# Altium project FET_Driver.PrjPcb (part 2 of 3)

## Sheet analog_converter.SchDoc
size B; Address1: MILWAUKEE TOOL; Address2: 13135 W. Lisbon Rd.; Address3: Brookfield, WI 53005; SheetNumber: 1; SheetTotal: 1
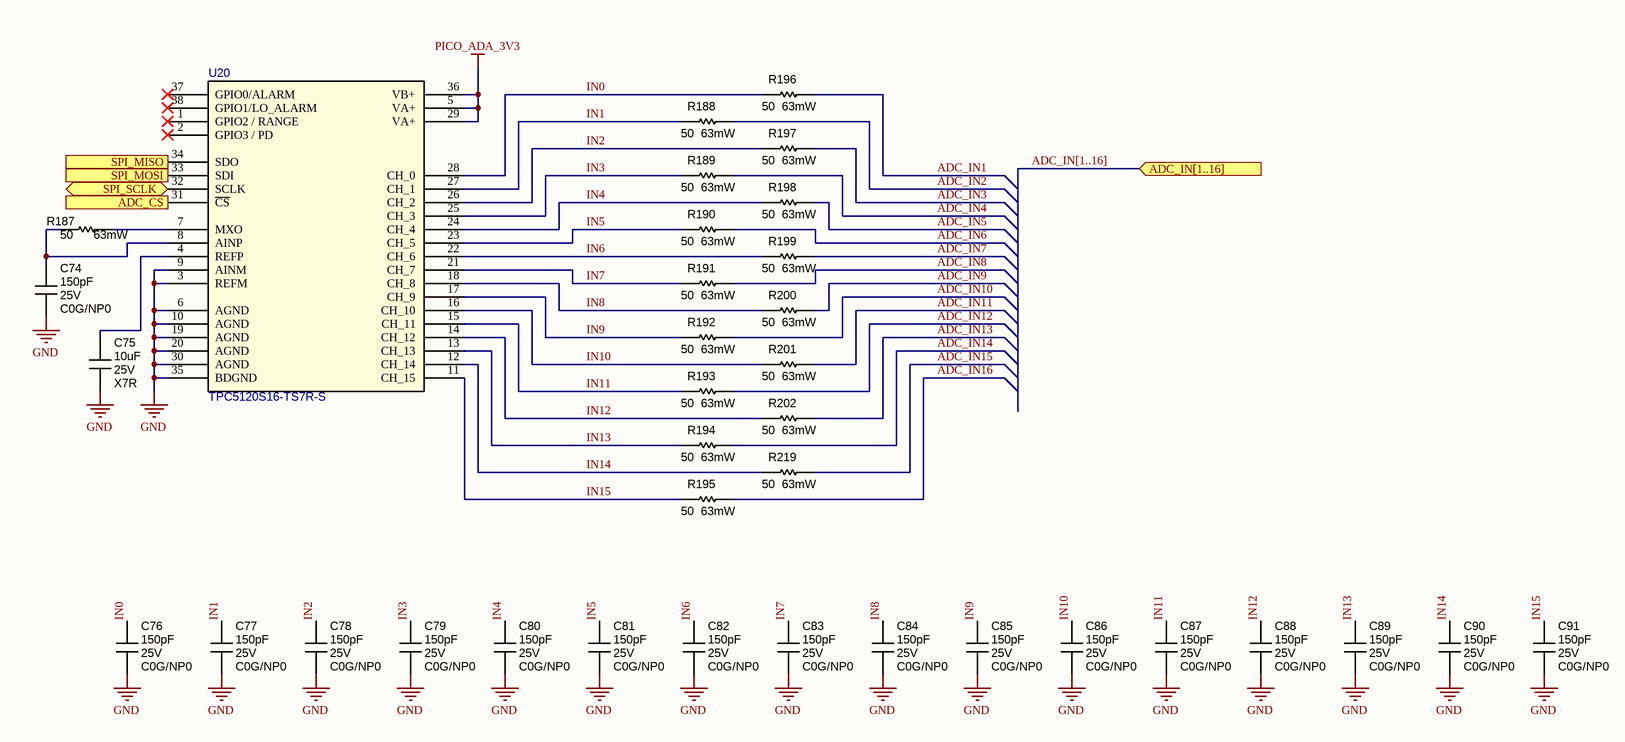
[diagram p5: analog_converter.SchDoc]

### Parts
C74  150pF  Voltage Rating: 25V  Temp Coeff: C0G/NP0  [CAPC1005X06N]
C75  10uF  Voltage Rating: 25V  Temp Coeff: X7R  [CAPC3225X28N]
C76  150pF  Voltage Rating: 25V  Temp Coeff: C0G/NP0  [CAPC1005X06N]
C77  150pF  Voltage Rating: 25V  Temp Coeff: C0G/NP0  [CAPC1005X06N]
C78  150pF  Voltage Rating: 25V  Temp Coeff: C0G/NP0  [CAPC1005X06N]
C79  150pF  Voltage Rating: 25V  Temp Coeff: C0G/NP0  [CAPC1005X06N]
C80  150pF  Voltage Rating: 25V  Temp Coeff: C0G/NP0  [CAPC1005X06N]
C81  150pF  Voltage Rating: 25V  Temp Coeff: C0G/NP0  [CAPC1005X06N]
C82  150pF  Voltage Rating: 25V  Temp Coeff: C0G/NP0  [CAPC1005X06N]
C83  150pF  Voltage Rating: 25V  Temp Coeff: C0G/NP0  [CAPC1005X06N]
C84  150pF  Voltage Rating: 25V  Temp Coeff: C0G/NP0  [CAPC1005X06N]
C85  150pF  Voltage Rating: 25V  Temp Coeff: C0G/NP0  [CAPC1005X06N]
C86  150pF  Voltage Rating: 25V  Temp Coeff: C0G/NP0  [CAPC1005X06N]
C87  150pF  Voltage Rating: 25V  Temp Coeff: C0G/NP0  [CAPC1005X06N]
C88  150pF  Voltage Rating: 25V  Temp Coeff: C0G/NP0  [CAPC1005X06N]
C89  150pF  Voltage Rating: 25V  Temp Coeff: C0G/NP0  [CAPC1005X06N]
C90  150pF  Voltage Rating: 25V  Temp Coeff: C0G/NP0  [CAPC1005X06N]
C91  150pF  Voltage Rating: 25V  Temp Coeff: C0G/NP0  [CAPC1005X06N]
R187  50  Wattage: 63mW  [RESC1005X04N]
R188  50  Wattage: 63mW  [RESC1005X04N]
R189  50  Wattage: 63mW  [RESC1005X04N]
R190  50  Wattage: 63mW  [RESC1005X04N]
R191  50  Wattage: 63mW  [RESC1005X04N]
R192  50  Wattage: 63mW  [RESC1005X04N]
R193  50  Wattage: 63mW  [RESC1005X04N]
R194  50  Wattage: 63mW  [RESC1005X04N]
R195  50  Wattage: 63mW  [RESC1005X04N]
R196  50  Wattage: 63mW  [RESC1005X04N]
R197  50  Wattage: 63mW  [RESC1005X04N]
R198  50  Wattage: 63mW  [RESC1005X04N]
R199  50  Wattage: 63mW  [RESC1005X04N]
R200  50  Wattage: 63mW  [RESC1005X04N]
R201  50  Wattage: 63mW  [RESC1005X04N]
R202  50  Wattage: 63mW  [RESC1005X04N]
R219  50  Wattage: 63mW  [RESC1005X04N]
U20  TPC5120S16-TS7R-S  [TSSOP50P640X120-38N]

### Ports
ADC_CS (in), ADC_IN[1..16] (in), SPI_MISO (out), SPI_MOSI (in), SPI_SCLK (bidir)

### Nets
GND: C74.2 C75.2 C76.2 C77.2 C78.2 C79.2 C80.2 C81.2 C82.2 C83.2 C84.2 C85.2 C86.2 C87.2 C88.2 C89.2 C90.2 C91.2 U20.3(REFM) U20.6(AGND) U20.9(AINM) U20.10(AGND) U20.19(AGND) U20.20(AGND) U20.30(AGND) U20.35(BDGND)
PICO_ADA_3V3: U20.5(VA+) U20.29(VA+) U20.36(VB+)
ADC_CHIP_SEL: U20.31(~{CS}) ; port ADC_CS
ADC_IN1: R196.2
ADC_IN2: R188.2
ADC_IN3: R197.2
ADC_IN4: R189.2
ADC_IN5: R198.2
ADC_IN6: R190.2
ADC_IN7: R199.2
ADC_IN8: R191.2
ADC_IN9: R200.2
ADC_IN10: R192.2
ADC_IN11: R201.2
ADC_IN12: R193.2
ADC_IN13: R202.2
ADC_IN14: R194.2
ADC_IN15: R219.2
ADC_IN16: R195.2
IN0: C76.1 R196.1 U20.28(CH_0)
IN1: C77.1 R188.1 U20.27(CH_1)
IN2: C78.1 R197.1 U20.26(CH_2)
IN3: C79.1 R189.1 U20.25(CH_3)
IN4: C80.1 R198.1 U20.24(CH_4)
IN5: C81.1 R190.1 U20.23(CH_5)
IN6: C82.1 R199.1 U20.22(CH_6)
IN7: C83.1 R191.1 U20.21(CH_7)
IN8: C84.1 R200.1 U20.18(CH_8)
IN9: C85.1 R192.1 U20.17(CH_9)
IN10: C86.1 R201.1 U20.16(CH_10)
IN11: C87.1 R193.1 U20.15(CH_11)
IN12: C88.1 R202.1 U20.14(CH_12)
IN13: C89.1 R194.1 U20.13(CH_13)
IN14: C90.1 R219.1 U20.12(CH_14)
IN15: C91.1 R195.1 U20.11(CH_15)
SPI0_CLK: U20.32(SCLK) ; port SPI_SCLK
SPI0_MISO: U20.34(SDO) ; port SPI_MISO
SPI0_MOSI: U20.33(SDI) ; port SPI_MOSI
NetC74_1: C74.1 R187.1 U20.8(AINP)
NetC75_1: C75.1 U20.4(REFP)
NetR187_2: R187.2 U20.7(MXO)

Not connected (* = marked no-connect by the designer): U20 1(GPIO2_/_RANGE)* 2(GPIO3_/_PD)* 37(GPIO0/ALARM)* 38(GPIO1/LO_ALARM)*

### Buses and harness runs
bus ADC_IN[1..16] = port ADC_IN[1..16]

### Notes on the sheet
- Schematic Notes
- Schematic Revision History
- Title
- ALL CAPACITORS ARE CERAMIC, 0603, 50V, 10%, X7R UNLESS OTHERWISE STATED
- ALL RESISTORS ARE FILM, 0603, 1/10W, 5%, 200ppm/°C UNLESS OTHERWISE STATED
- Size:
- Date:
- B
- Number:
- Sheet
- Revision:
- of
- Drawn By:
- Brookfield, WI 53005
- File:
- Platform Base:
- Engineer:
- This Document is the property of MILWAUKEE TOOL and may not be reproduced, in any form, without the written premission of MILWAUKEE TOOL.

### Library data of the parts
C74 C76-C91 = CMP-004-0079: CAP CER 150PF 25V C0G/NP0 0402; MFR#: C0402C151J3GACTU; MFR: KEMET; MFR2#: CC0402JRNPO8BN151; Tolerance: 5%; Populate: Yes; Temp Range: -55 / +125 C; Capacitor Type: Ceramic; Case Code (Imperial): 0402; Value: 150pF; Design Item ID: CN/150PF/25V/C0G,NP0/5%/0402; Case Code (Metric): 1005; ComponentLink1URL: https://search.murata.co.jp/Ceramy/image/img/A01X/G101/ENG/GCM155R71H103KA55-01.pdf; MFR2: Yageo; ComponentLink1Description: Datasheet; RoHS Compliant: Yes; Part Status: Production
C75 = CMP-004-0004: CAP CER 10UF 25V X7R 1206; MFR#: GRM31CR71E106KA12L; MFR2#: C3216X7R1E106K160AB; MFR: Murata Electronics; Capacitor Type: Ceramic; Tolerance: 10%; Temp Range: -55 / +125 C; REACH SVHC: Yes; Value: 10uF; Height: 1.6mm; ComponentLink1Description: Datasheet; MFR2: TDK Corporation; Case Code (Metric): 3216; ComponentLink1URL: https://www.murata.com/-/media/webrenewal/support/library/catalog/products/capacitor/ceramiccapacitor/c02e.ashx?la=en-us&cvid=20210120024548000000; RoHS Compliant: Yes; Case Code (Imperial): 1206; Design Item ID: CN/10uF/25V/X7R/10%/1206
R187-R202 R219 = CMP-025-0174: RES SMD 50R OHM 1% 1/16W 0402; MFR#: RN73R1ETTP50R0F50; MFR: KOA Speer Electronics; Value: 50 Ohm; Temp Range: -55 / +155 C; Temperature Coefficient: 50 ppm/°C; Populate: Yes; Tolerance: 1%; ComponentLink1Description: Datasheet; ComponentLink1URL: https://www.koaspeer.com/pdfs/RN73R.pdf; Resistor Type: Thick Film; Case Code (Imperial): 0402; Case Code (Metric): 1005; Design Item ID: R/50.0/0.063W/1%/0402; RoHS Compliant: Yes; Part Status: Production
U20 = CMP-017-0116: IC 12 BIT ANALOG TO DIGITAL CONVERT SPI; MFR: 3PEAK; Populate: Yes; REACFH SVCH: Unaffected; Temp Range, Ambient: -40 / +125 C; Voltage Range: 2.7V - 5.25V DC; Temp Range, Junction: -40 / +150C; Value: TPC5120S16-TS7R-S; MFR#: TPC5120S16-TS7R-S; Case Package: TSSOP38; Design Item ID: IC/ADC/12BIT/TPC5120S16-TS7R-S/3PEAK; Part Status: Production; RoHS Comliant: Yes; Type: THERMOCOUPLE; ComponentLink1Description: Datasheet; ComponentLink1URL: https://static.3peak.com/res/doc/ds/Datasheet_TPC5120-TPC5121.pdf

## Sheet display.SchDoc
size B; Address1: MILWAUKEE TOOL; Address2: 13135 W. Lisbon Rd.; Address3: Brookfield, WI 53005; SheetNumber: 1; SheetTotal: 1
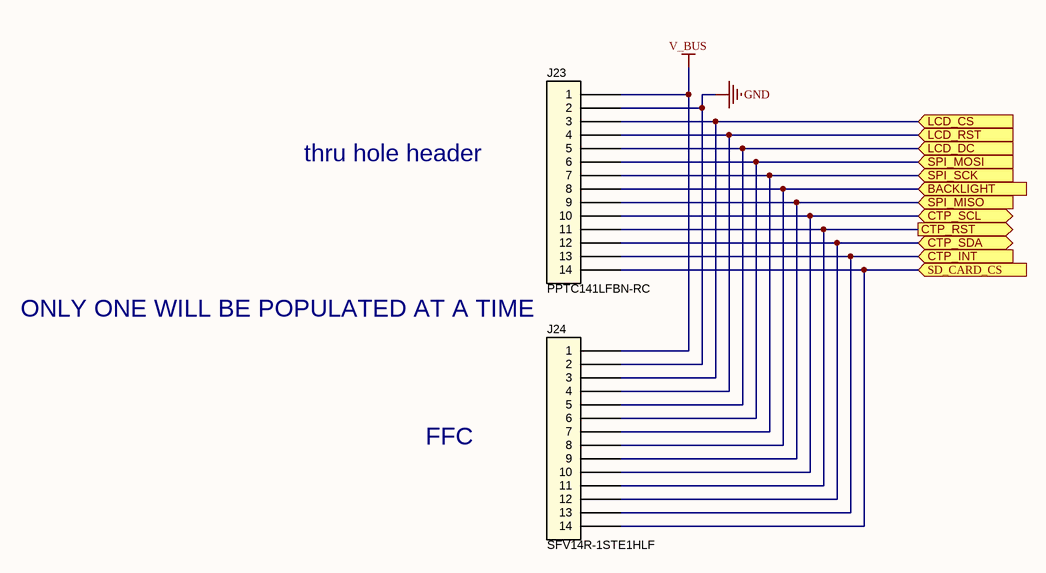
[diagram p6: display.SchDoc]

### Parts
J23  PPTC141LFBN-RC  [CONN_SULLINS_PPTC141LFBN-RC]
J24  SFV14R-1STE1HLF  [CONN_AMPHENOL_SFV14R-1STE1HLF]

### Ports
BACKLIGHT (in), CTP_INT (in), CTP_RST (out), CTP_SCL (bidir), CTP_SDA (bidir), LCD_CS (in), LCD_DC (in), LCD_RST (in), SD_CARD_CS (in), SPI_MISO (in), SPI_MOSI (in), SPI_SCK (in)

### Nets
GND: J23.2 J24.2
V_BUS: J23.1 J24.1
CAP_TOUCH_INT: J23.13 J24.13 ; port CTP_INT
CAP_TOUCH_RST: J23.11 J24.11 ; port CTP_RST
DISP_BACKLIGHT: J23.8 J24.8 ; port BACKLIGHT
DISP_CS: J23.3 J24.3 ; port LCD_CS
DISP_DC: J23.5 J24.5 ; port LCD_DC
DISP_RST: J23.4 J24.4 ; port LCD_RST
DISP_SD_CARD_CS: J23.14 J24.14 ; port SD_CARD_CS
I2C0_SCL: J23.10 J24.10 ; port CTP_SCL
I2C0_SDA: J23.12 J24.12 ; port CTP_SDA
SPI0_CLK: J23.7 J24.7 ; port SPI_SCK
SPI0_MISO: J23.9 J24.9 ; port SPI_MISO
SPI0_MOSI: J23.6 J24.6 ; port SPI_MOSI

### Notes on the sheet
- thru hole header
- ONLY ONE WILL BE POPULATED AT A TIME
- FFC
- Schematic Notes
- Schematic Revision History
- Title
- ALL CAPACITORS ARE CERAMIC, 0603, 50V, 10%, X7R UNLESS OTHERWISE STATED
- ALL RESISTORS ARE FILM, 0603, 1/10W, 5%, 200ppm/°C UNLESS OTHERWISE STATED
- Size:
- Date:
- B
- Number:
- Sheet
- Revision:
- of
- Drawn By:
- Brookfield, WI 53005
- File:
- Platform Base:
- Engineer:
- This Document is the property of MILWAUKEE TOOL and may not be reproduced, in any form, without the written premission of MILWAUKEE TOOL.

### Library data of the parts
J23 = CMP-007-0083: CONN HEADER RECEPTACLE VERT 14POS 2.54MM GOLD; MFR: Sullins Connector Solutions; Voltage Rating: 250V AC(RMS)/DC; Durability: 50 mating cycles; Current Rating: 1A; System: Connector; Temp Range: -40 / +105 C; Gender: Male; Value: PPTC141LFBN-RC; Orientation: Verticle; Terminal Pitch: 2.54mm; RoHS Compliant: Yes; Design Item ID: CON/14P/2.54mm/1A/PPTC141LFBN-RC/SULLINS; MFR#: PPTC141LFBN-RC; Contact Finish: Tin; ComponentLink1Description: Drawing; ComponentLink1URL: https://mm.digikey.com/Volume0/opasdata/d220001/medias/docus/937/Female_Headers.100_DS.pdf
J24 = CMP-007-0082: CONN FFC BOTTOM 14POS 0.5MM R/A; MFR: Amphenol ICC (FCI); Voltage Rating: 250V AC(RMS)/DC; Durability: 50 mating cycles; Current Rating: 0.5A; System: Connector; Temp Range: -55 / +105 C; Gender: Male; Value: SFV14R-1STE1HLF; Orientation: Right Angle; Terminal Pitch: 0.5mm; RoHS Compliant: Yes; Design Item ID: CON/14P/0.5mm/0.5A/SFV14R-1STBE1HLF/Amphenol; MFR#: SFV14R-1STE1HLF; Contact Finish: Gold; ComponentLink1Description: Drawing; ComponentLink1URL: https://cdn.amphenol-cs.com/media/wysiwyg/files/documentation/datasheet/flex/flexconnectors_050mm_sfvr.pdf

## Sheet thermocouple_1.SchDoc
size B; Address1: MILWAUKEE TOOL; Address2: 13135 W. Lisbon Rd.; Address3: Brookfield, WI 53005; SheetNumber: 1; SheetTotal: 1
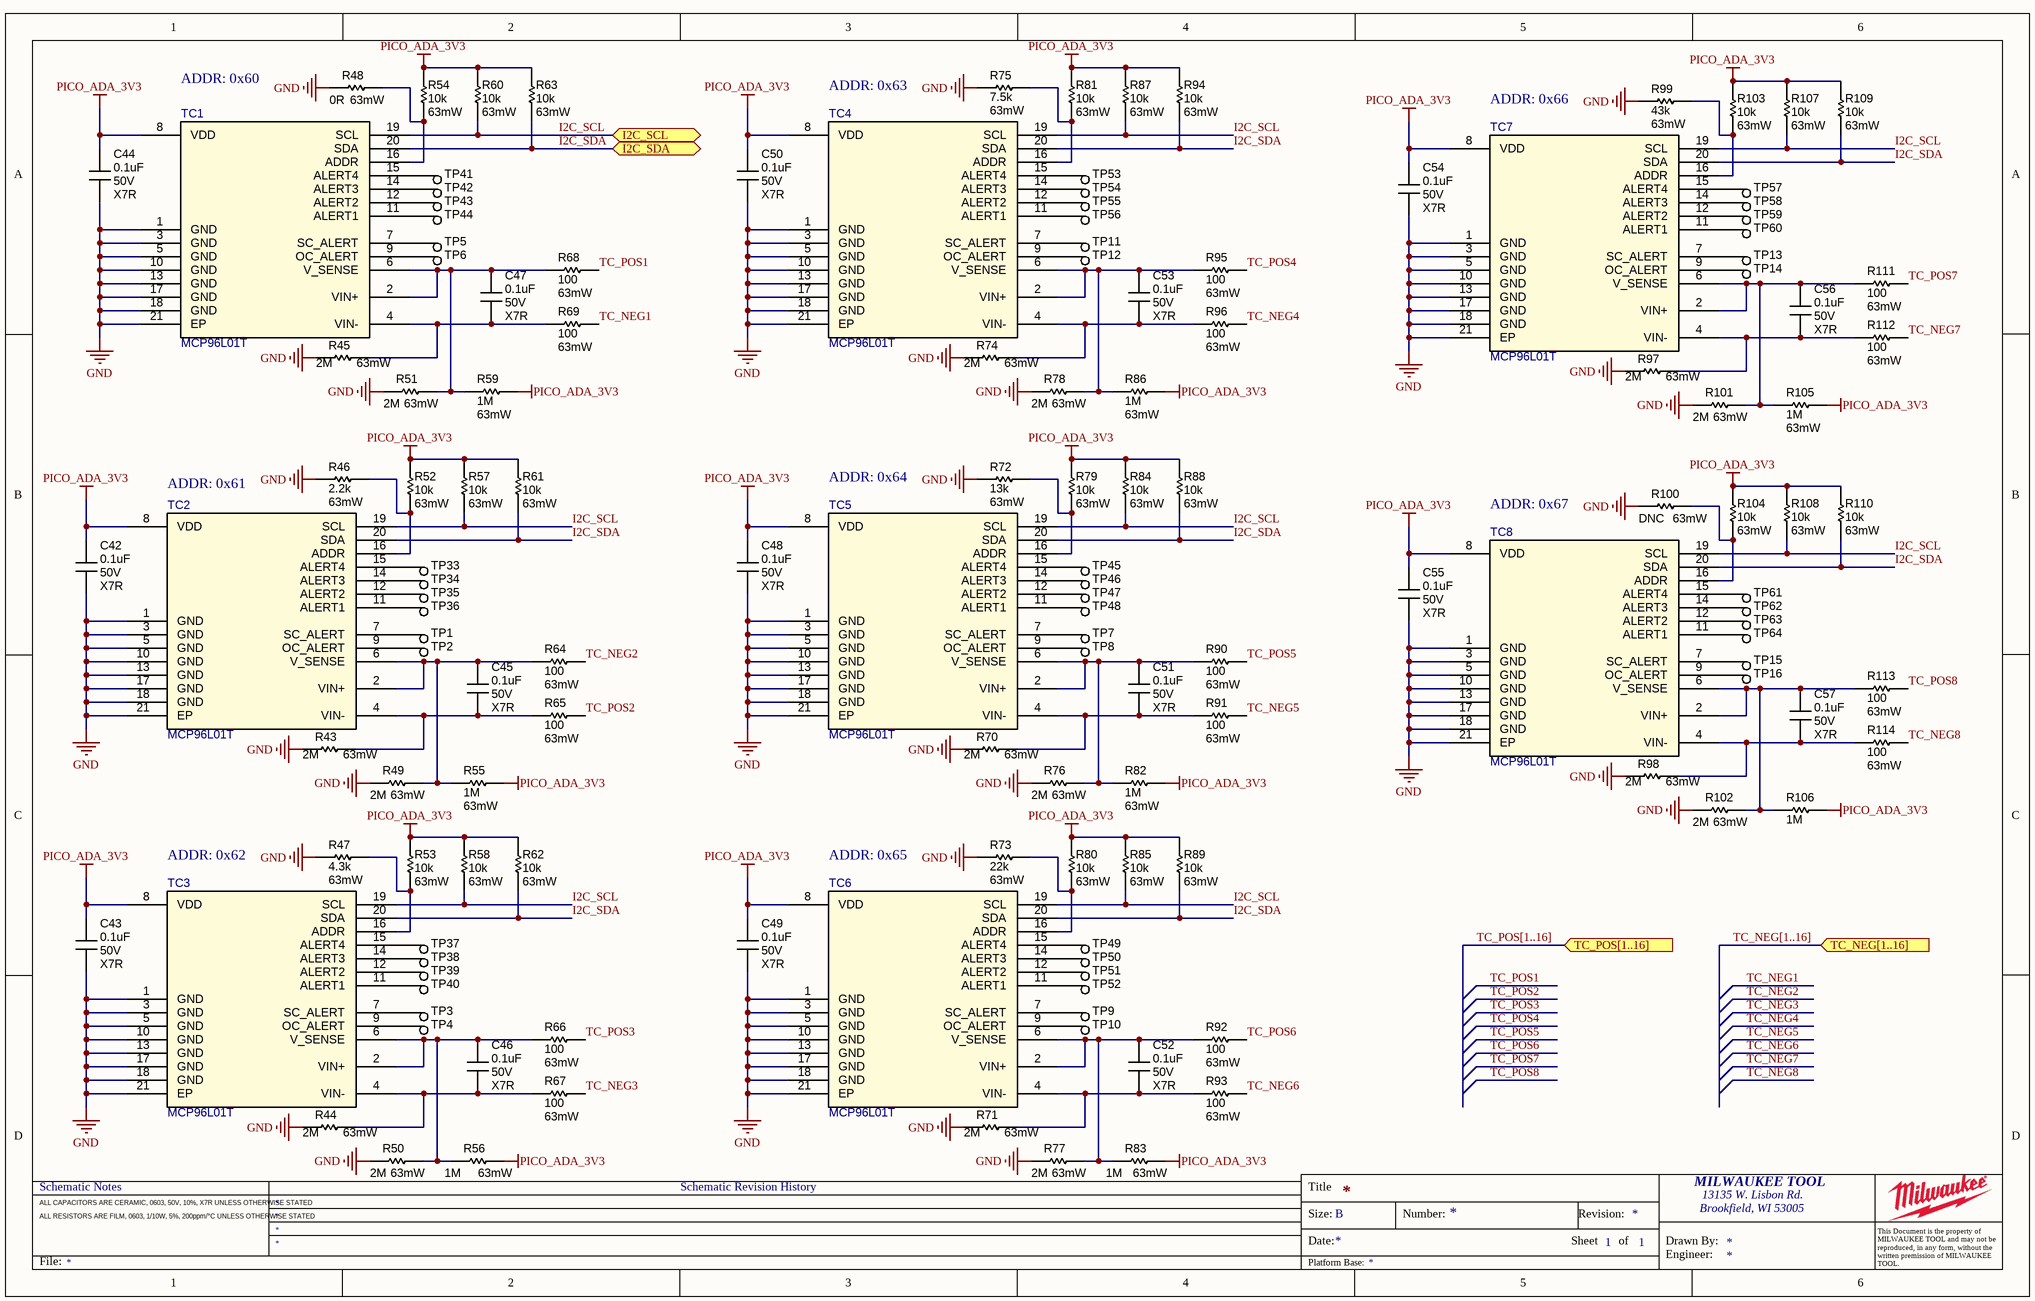
[diagram p7: thermocouple_1.SchDoc]

### Parts
C42  0.1uF  Voltage Rating: 50V  Temp Coeff: X7R  [CAPC1608X09N]
C43  0.1uF  Voltage Rating: 50V  Temp Coeff: X7R  [CAPC1608X09N]
C44  0.1uF  Voltage Rating: 50V  Temp Coeff: X7R  [CAPC1608X09N]
C45  0.1uF  Voltage Rating: 50V  Temp Coeff: X7R  [CAPC1005X06N]
C46  0.1uF  Voltage Rating: 50V  Temp Coeff: X7R  [CAPC1005X06N]
C47  0.1uF  Voltage Rating: 50V  Temp Coeff: X7R  [CAPC1005X06N]
C48  0.1uF  Voltage Rating: 50V  Temp Coeff: X7R  [CAPC1608X09N]
C49  0.1uF  Voltage Rating: 50V  Temp Coeff: X7R  [CAPC1608X09N]
C50  0.1uF  Voltage Rating: 50V  Temp Coeff: X7R  [CAPC1608X09N]
C51  0.1uF  Voltage Rating: 50V  Temp Coeff: X7R  [CAPC1005X06N]
C52  0.1uF  Voltage Rating: 50V  Temp Coeff: X7R  [CAPC1005X06N]
C53  0.1uF  Voltage Rating: 50V  Temp Coeff: X7R  [CAPC1005X06N]
C54  0.1uF  Voltage Rating: 50V  Temp Coeff: X7R  [CAPC1608X09N]
C55  0.1uF  Voltage Rating: 50V  Temp Coeff: X7R  [CAPC1608X09N]
C56  0.1uF  Voltage Rating: 50V  Temp Coeff: X7R  [CAPC1005X06N]
C57  0.1uF  Voltage Rating: 50V  Temp Coeff: X7R  [CAPC1005X06N]
R43  2M  Wattage: 63mW  [RESC1005X04N]
R44  2M  Wattage: 63mW  [RESC1005X04N]
R45  2M  Wattage: 63mW  [RESC1005X04N]
R46  2.2k  Wattage: 63mW  [RESC1005X04N]
R47  4.3k  Wattage: 63mW  [RESC1005X04N]
R48  0R  Wattage: 63mW  [RESC1005X04N]
R49  2M  Wattage: 63mW  [RESC1005X04N]
R50  2M  Wattage: 63mW  [RESC1005X04N]
R51  2M  Wattage: 63mW  [RESC1005X04N]
R52  10k  Wattage: 63mW  [RESC1005X04N]
R53  10k  Wattage: 63mW  [RESC1005X04N]
R54  10k  Wattage: 63mW  [RESC1005X04N]
R55  1M  Wattage: 63mW  [RESC1005X04N]
R56  1M  Wattage: 63mW  [RESC1005X04N]
R57  10k  Wattage: 63mW  [RESC1005X04N]
R58  10k  Wattage: 63mW  [RESC1005X04N]
R59  1M  Wattage: 63mW  [RESC1005X04N]
R60  10k  Wattage: 63mW  [RESC1005X04N]
R61  10k  Wattage: 63mW  [RESC1005X04N]
R62  10k  Wattage: 63mW  [RESC1005X04N]
R63  10k  Wattage: 63mW  [RESC1005X04N]
R64  100  Wattage: 63mW  [RESC1005X04N]
R65  100  Wattage: 63mW  [RESC1005X04N]
R66  100  Wattage: 63mW  [RESC1005X04N]
R67  100  Wattage: 63mW  [RESC1005X04N]
R68  100  Wattage: 63mW  [RESC1005X04N]
R69  100  Wattage: 63mW  [RESC1005X04N]
R70  2M  Wattage: 63mW  [RESC1005X04N]
R71  2M  Wattage: 63mW  [RESC1005X04N]
R72  13k  Wattage: 63mW  [RESC1005X04N]
R73  22k  Wattage: 63mW  [RESC1005X04N]
R74  2M  Wattage: 63mW  [RESC1005X04N]
R75  7.5k  Wattage: 63mW  [RESC1005X04N]
R76  2M  Wattage: 63mW  [RESC1005X04N]
R77  2M  Wattage: 63mW  [RESC1005X04N]
R78  2M  Wattage: 63mW  [RESC1005X04N]
R79  10k  Wattage: 63mW  [RESC1005X04N]
R80  10k  Wattage: 63mW  [RESC1005X04N]
R81  10k  Wattage: 63mW  [RESC1005X04N]
R82  1M  Wattage: 63mW  [RESC1005X04N]
R83  1M  Wattage: 63mW  [RESC1005X04N]
R84  10k  Wattage: 63mW  [RESC1005X04N]
R85  10k  Wattage: 63mW  [RESC1005X04N]
R86  1M  Wattage: 63mW  [RESC1005X04N]
R87  10k  Wattage: 63mW  [RESC1005X04N]
R88  10k  Wattage: 63mW  [RESC1005X04N]
R89  10k  Wattage: 63mW  [RESC1005X04N]
R90  100  Wattage: 63mW  [RESC1005X04N]
R91  100  Wattage: 63mW  [RESC1005X04N]
R92  100  Wattage: 63mW  [RESC1005X04N]
R93  100  Wattage: 63mW  [RESC1005X04N]
R94  10k  Wattage: 63mW  [RESC1005X04N]
R95  100  Wattage: 63mW  [RESC1005X04N]
R96  100  Wattage: 63mW  [RESC1005X04N]
R97  2M  Wattage: 63mW  [RESC1005X04N]
R98  2M  Wattage: 63mW  [RESC1005X04N]
R99  43k  Wattage: 63mW  [RESC1005X04N]
R100  DNC  Wattage: 63mW  [RESC1005X04N]
R101  2M  Wattage: 63mW  [RESC1005X04N]
R102  2M  Wattage: 63mW  [RESC1005X04N]
R103  10k  Wattage: 63mW  [RESC1005X04N]
R104  10k  Wattage: 63mW  [RESC1005X04N]
R105  1M  Wattage: 63mW  [RESC1005X04N]
R106  1M  [RESC1005X04N]
R107  10k  Wattage: 63mW  [RESC1005X04N]
R108  10k  Wattage: 63mW  [RESC1005X04N]
R109  10k  Wattage: 63mW  [RESC1005X04N]
R110  10k  Wattage: 63mW  [RESC1005X04N]
R111  100  Wattage: 63mW  [RESC1005X04N]
R112  100  Wattage: 63mW  [RESC1005X04N]
R113  100  Wattage: 63mW  [RESC1005X04N]
R114  100  Wattage: 63mW  [RESC1005X04N]
TC1  MCP96L01T  [QFN65P500X500X100_HS-21N]
TC2  MCP96L01T  [QFN65P500X500X100_HS-21N]
TC3  MCP96L01T  [QFN65P500X500X100_HS-21N]
TC4  MCP96L01T  [QFN65P500X500X100_HS-21N]
TC5  MCP96L01T  [QFN65P500X500X100_HS-21N]
TC6  MCP96L01T  [QFN65P500X500X100_HS-21N]
TC7  MCP96L01T  [QFN65P500X500X100_HS-21N]
TC8  MCP96L01T  [QFN65P500X500X100_HS-21N]
TP1  TP_SMT_1MM_CIR  [TP_SMT_1.0MM_CIR]  (value not drawn)  (no BOM)
TP2  TP_SMT_1MM_CIR  [TP_SMT_1.0MM_CIR]  (value not drawn)  (no BOM)
TP3  TP_SMT_1MM_CIR  [TP_SMT_1.0MM_CIR]  (value not drawn)  (no BOM)
TP4  TP_SMT_1MM_CIR  [TP_SMT_1.0MM_CIR]  (value not drawn)  (no BOM)
TP5  TP_SMT_1MM_CIR  [TP_SMT_1.0MM_CIR]  (value not drawn)  (no BOM)
TP6  TP_SMT_1MM_CIR  [TP_SMT_1.0MM_CIR]  (value not drawn)  (no BOM)
TP7  TP_SMT_1MM_CIR  [TP_SMT_1.0MM_CIR]  (value not drawn)  (no BOM)
TP8  TP_SMT_1MM_CIR  [TP_SMT_1.0MM_CIR]  (value not drawn)  (no BOM)
TP9  TP_SMT_1MM_CIR  [TP_SMT_1.0MM_CIR]  (value not drawn)  (no BOM)
TP10  TP_SMT_1MM_CIR  [TP_SMT_1.0MM_CIR]  (value not drawn)  (no BOM)
TP11  TP_SMT_1MM_CIR  [TP_SMT_1.0MM_CIR]  (value not drawn)  (no BOM)
TP12  TP_SMT_1MM_CIR  [TP_SMT_1.0MM_CIR]  (value not drawn)  (no BOM)
TP13  TP_SMT_1MM_CIR  [TP_SMT_1.0MM_CIR]  (value not drawn)  (no BOM)
TP14  TP_SMT_1MM_CIR  [TP_SMT_1.0MM_CIR]  (value not drawn)  (no BOM)
TP15  TP_SMT_1MM_CIR  [TP_SMT_1.0MM_CIR]  (value not drawn)  (no BOM)
TP16  TP_SMT_1MM_CIR  [TP_SMT_1.0MM_CIR]  (value not drawn)  (no BOM)
TP33  TP_SMT_1MM_CIR  [TP_SMT_1.0MM_CIR]  (value not drawn)  (no BOM)
TP34  TP_SMT_1MM_CIR  [TP_SMT_1.0MM_CIR]  (value not drawn)  (no BOM)
TP35  TP_SMT_1MM_CIR  [TP_SMT_1.0MM_CIR]  (value not drawn)  (no BOM)
TP36  TP_SMT_1MM_CIR  [TP_SMT_1.0MM_CIR]  (value not drawn)  (no BOM)
TP37  TP_SMT_1MM_CIR  [TP_SMT_1.0MM_CIR]  (value not drawn)  (no BOM)
TP38  TP_SMT_1MM_CIR  [TP_SMT_1.0MM_CIR]  (value not drawn)  (no BOM)
TP39  TP_SMT_1MM_CIR  [TP_SMT_1.0MM_CIR]  (value not drawn)  (no BOM)
TP40  TP_SMT_1MM_CIR  [TP_SMT_1.0MM_CIR]  (value not drawn)  (no BOM)
TP41  TP_SMT_1MM_CIR  [TP_SMT_1.0MM_CIR]  (value not drawn)  (no BOM)
TP42  TP_SMT_1MM_CIR  [TP_SMT_1.0MM_CIR]  (value not drawn)  (no BOM)
TP43  TP_SMT_1MM_CIR  [TP_SMT_1.0MM_CIR]  (value not drawn)  (no BOM)
TP44  TP_SMT_1MM_CIR  [TP_SMT_1.0MM_CIR]  (value not drawn)  (no BOM)
TP45  TP_SMT_1MM_CIR  [TP_SMT_1.0MM_CIR]  (value not drawn)  (no BOM)
TP46  TP_SMT_1MM_CIR  [TP_SMT_1.0MM_CIR]  (value not drawn)  (no BOM)
TP47  TP_SMT_1MM_CIR  [TP_SMT_1.0MM_CIR]  (value not drawn)  (no BOM)
TP48  TP_SMT_1MM_CIR  [TP_SMT_1.0MM_CIR]  (value not drawn)  (no BOM)
TP49  TP_SMT_1MM_CIR  [TP_SMT_1.0MM_CIR]  (value not drawn)  (no BOM)
TP50  TP_SMT_1MM_CIR  [TP_SMT_1.0MM_CIR]  (value not drawn)  (no BOM)
TP51  TP_SMT_1MM_CIR  [TP_SMT_1.0MM_CIR]  (value not drawn)  (no BOM)
TP52  TP_SMT_1MM_CIR  [TP_SMT_1.0MM_CIR]  (value not drawn)  (no BOM)
TP53  TP_SMT_1MM_CIR  [TP_SMT_1.0MM_CIR]  (value not drawn)  (no BOM)
TP54  TP_SMT_1MM_CIR  [TP_SMT_1.0MM_CIR]  (value not drawn)  (no BOM)
TP55  TP_SMT_1MM_CIR  [TP_SMT_1.0MM_CIR]  (value not drawn)  (no BOM)
TP56  TP_SMT_1MM_CIR  [TP_SMT_1.0MM_CIR]  (value not drawn)  (no BOM)
TP57  TP_SMT_1MM_CIR  [TP_SMT_1.0MM_CIR]  (value not drawn)  (no BOM)
TP58  TP_SMT_1MM_CIR  [TP_SMT_1.0MM_CIR]  (value not drawn)  (no BOM)
TP59  TP_SMT_1MM_CIR  [TP_SMT_1.0MM_CIR]  (value not drawn)  (no BOM)
TP60  TP_SMT_1MM_CIR  [TP_SMT_1.0MM_CIR]  (value not drawn)  (no BOM)
TP61  TP_SMT_1MM_CIR  [TP_SMT_1.0MM_CIR]  (value not drawn)  (no BOM)
TP62  TP_SMT_1MM_CIR  [TP_SMT_1.0MM_CIR]  (value not drawn)  (no BOM)
TP63  TP_SMT_1MM_CIR  [TP_SMT_1.0MM_CIR]  (value not drawn)  (no BOM)
TP64  TP_SMT_1MM_CIR  [TP_SMT_1.0MM_CIR]  (value not drawn)  (no BOM)

### Ports
I2C_SCL (bidir), I2C_SDA (bidir), TC_NEG[1..16] (in), TC_POS[1..16] (in)

### Nets
GND: C42.2 C43.2 C44.2 C48.2 C49.2 C50.2 C54.2 C55.2 R43.1 R44.1 R45.1 R46.1 R47.1 R48.1 R49.1 R50.1 R51.1 R70.1 R71.1 R72.1 R73.1 R74.1 R75.1 R76.1 R77.1 R78.1 R97.1 R98.1 R99.1 R100.1 R101.1 R102.1 TC1.1(GND) TC1.3(GND) TC1.5(GND) TC1.10(GND) TC1.13(GND) TC1.17(GND) TC1.18(GND) TC1.21(EP) TC2.1(GND) TC2.3(GND) TC2.5(GND) TC2.10(GND) TC2.13(GND) TC2.17(GND) TC2.18(GND) TC2.21(EP) TC3.1(GND) TC3.3(GND) TC3.5(GND) TC3.10(GND) TC3.13(GND) TC3.17(GND) TC3.18(GND) TC3.21(EP) TC4.1(GND) TC4.3(GND) TC4.5(GND) TC4.10(GND) TC4.13(GND) TC4.17(GND) TC4.18(GND) TC4.21(EP) TC5.1(GND) TC5.3(GND) TC5.5(GND) TC5.10(GND) TC5.13(GND) TC5.17(GND) TC5.18(GND) TC5.21(EP) TC6.1(GND) TC6.3(GND) TC6.5(GND) TC6.10(GND) TC6.13(GND) TC6.17(GND) TC6.18(GND) TC6.21(EP) TC7.1(GND) TC7.3(GND) TC7.5(GND) TC7.10(GND) TC7.13(GND) TC7.17(GND) TC7.18(GND) TC7.21(EP) TC8.1(GND) TC8.3(GND) TC8.5(GND) TC8.10(GND) TC8.13(GND) TC8.17(GND) TC8.18(GND) TC8.21(EP)
PICO_ADA_3V3: C42.1 C43.1 C44.1 C48.1 C49.1 C50.1 C54.1 C55.1 R52.2 R53.2 R54.2 R55.2 R56.2 R57.2 R58.2 R59.2 R60.2 R61.2 R62.2 R63.2 R79.2 R80.2 R81.2 R82.2 R83.2 R84.2 R85.2 R86.2 R87.2 R88.2 R89.2 R94.2 R103.2 R104.2 R105.2 R106.2 R107.2 R108.2 R109.2 R110.2 TC1.8(VDD) TC2.8(VDD) TC3.8(VDD) TC4.8(VDD) TC5.8(VDD) TC6.8(VDD) TC7.8(VDD) TC8.8(VDD)
I2C_SCL: R57.1 R58.1 R60.1 R84.1 R85.1 R87.1 R107.1 R108.1 TC1.19(SCL) TC2.19(SCL) TC3.19(SCL) TC4.19(SCL) TC5.19(SCL) TC6.19(SCL) TC7.19(SCL) TC8.19(SCL) ; port I2C_SCL
I2C_SDA: R61.1 R62.1 R63.1 R88.1 R89.1 R94.1 R109.1 R110.1 TC1.20(SDA) TC2.20(SDA) TC3.20(SDA) TC4.20(SDA) TC5.20(SDA) TC6.20(SDA) TC7.20(SDA) TC8.20(SDA) ; port I2C_SDA
TC_NEG1: R69.2
TC_NEG2: R64.2
TC_NEG3: R67.2
TC_NEG4: R96.2
TC_NEG5: R91.2
TC_NEG6: R93.2
TC_NEG7: R112.2
TC_NEG8: R114.2
TC_POS1: R68.2
TC_POS2: R65.2
TC_POS3: R66.2
TC_POS4: R95.2
TC_POS5: R90.2
TC_POS6: R92.2
TC_POS7: R111.2
TC_POS8: R113.2
NetC45_1: C45.1 R49.2 R55.1 R64.1 TC2.2(VIN+) TC2.6(V_SENSE)
NetC45_2: C45.2 R43.2 R65.1 TC2.4(VIN-)
NetC46_1: C46.1 R50.2 R56.1 R66.1 TC3.2(VIN+) TC3.6(V_SENSE)
NetC46_2: C46.2 R44.2 R67.1 TC3.4(VIN-)
NetC47_1: C47.1 R51.2 R59.1 R68.1 TC1.2(VIN+) TC1.6(V_SENSE)
NetC47_2: C47.2 R45.2 R69.1 TC1.4(VIN-)
NetC51_1: C51.1 R76.2 R82.1 R90.1 TC5.2(VIN+) TC5.6(V_SENSE)
NetC51_2: C51.2 R70.2 R91.1 TC5.4(VIN-)
NetC52_1: C52.1 R77.2 R83.1 R92.1 TC6.2(VIN+) TC6.6(V_SENSE)
NetC52_2: C52.2 R71.2 R93.1 TC6.4(VIN-)
NetC53_1: C53.1 R78.2 R86.1 R95.1 TC4.2(VIN+) TC4.6(V_SENSE)
NetC53_2: C53.2 R74.2 R96.1 TC4.4(VIN-)
NetC56_1: C56.1 R101.2 R105.1 R111.1 TC7.2(VIN+) TC7.6(V_SENSE)
NetC56_2: C56.2 R97.2 R112.1 TC7.4(VIN-)
NetC57_1: C57.1 R102.2 R106.1 R113.1 TC8.2(VIN+) TC8.6(V_SENSE)
NetC57_2: C57.2 R98.2 R114.1 TC8.4(VIN-)
NetR46_2: R46.2 R52.1 TC2.16(ADDR)
NetR47_2: R47.2 R53.1 TC3.16(ADDR)
NetR48_2: R48.2 R54.1 TC1.16(ADDR)
NetR72_2: R72.2 R79.1 TC5.16(ADDR)
NetR73_2: R73.2 R80.1 TC6.16(ADDR)
NetR75_2: R75.2 R81.1 TC4.16(ADDR)
NetR99_2: R99.2 R103.1 TC7.16(ADDR)
NetR100_2: R100.2 R104.1 TC8.16(ADDR)
NetTC1_7: TC1.7(SC_ALERT) TP5.1
NetTC1_9: TC1.9(OC_ALERT) TP6.1
NetTC1_11: TC1.11(ALERT1) TP44.1
NetTC1_12: TC1.12(ALERT2) TP43.1
NetTC1_14: TC1.14(ALERT3) TP42.1
NetTC1_15: TC1.15(ALERT4) TP41.1
NetTC2_7: TC2.7(SC_ALERT) TP1.1
NetTC2_9: TC2.9(OC_ALERT) TP2.1
NetTC2_11: TC2.11(ALERT1) TP36.1
NetTC2_12: TC2.12(ALERT2) TP35.1
NetTC2_14: TC2.14(ALERT3) TP34.1
NetTC2_15: TC2.15(ALERT4) TP33.1
NetTC3_7: TC3.7(SC_ALERT) TP3.1
NetTC3_9: TC3.9(OC_ALERT) TP4.1
NetTC3_11: TC3.11(ALERT1) TP40.1
NetTC3_12: TC3.12(ALERT2) TP39.1
NetTC3_14: TC3.14(ALERT3) TP38.1
NetTC3_15: TC3.15(ALERT4) TP37.1
NetTC4_7: TC4.7(SC_ALERT) TP11.1
NetTC4_9: TC4.9(OC_ALERT) TP12.1
NetTC4_11: TC4.11(ALERT1) TP56.1
NetTC4_12: TC4.12(ALERT2) TP55.1
NetTC4_14: TC4.14(ALERT3) TP54.1
NetTC4_15: TC4.15(ALERT4) TP53.1
NetTC5_7: TC5.7(SC_ALERT) TP7.1
NetTC5_9: TC5.9(OC_ALERT) TP8.1
NetTC5_11: TC5.11(ALERT1) TP48.1
NetTC5_12: TC5.12(ALERT2) TP47.1
NetTC5_14: TC5.14(ALERT3) TP46.1
NetTC5_15: TC5.15(ALERT4) TP45.1
NetTC6_7: TC6.7(SC_ALERT) TP9.1
NetTC6_9: TC6.9(OC_ALERT) TP10.1
NetTC6_11: TC6.11(ALERT1) TP52.1
NetTC6_12: TC6.12(ALERT2) TP51.1
NetTC6_14: TC6.14(ALERT3) TP50.1
NetTC6_15: TC6.15(ALERT4) TP49.1
NetTC7_7: TC7.7(SC_ALERT) TP13.1
NetTC7_9: TC7.9(OC_ALERT) TP14.1
NetTC7_11: TC7.11(ALERT1) TP60.1
NetTC7_12: TC7.12(ALERT2) TP59.1
NetTC7_14: TC7.14(ALERT3) TP58.1
NetTC7_15: TC7.15(ALERT4) TP57.1
NetTC8_7: TC8.7(SC_ALERT) TP15.1
NetTC8_9: TC8.9(OC_ALERT) TP16.1
NetTC8_11: TC8.11(ALERT1) TP64.1
NetTC8_12: TC8.12(ALERT2) TP63.1
NetTC8_14: TC8.14(ALERT3) TP62.1
NetTC8_15: TC8.15(ALERT4) TP61.1

### Buses and harness runs
bus TC_NEG[1..16] = port TC_NEG[1..16]
bus TC_POS[1..16] = port TC_POS[1..16]

### Notes on the sheet
- (near TC1) ADDR: 0x60
- (near TC4) ADDR: 0x63
- (near TC7) ADDR: 0x66
- (near TC2) ADDR: 0x61
- (near TC5) ADDR: 0x64
- (near TC8) ADDR: 0x67
- (near TC3) ADDR: 0x62
- (near TC6) ADDR: 0x65
- Schematic Notes
- Schematic Revision History
- Title
- ALL CAPACITORS ARE CERAMIC, 0603, 50V, 10%, X7R UNLESS OTHERWISE STATED
- ALL RESISTORS ARE FILM, 0603, 1/10W, 5%, 200ppm/°C UNLESS OTHERWISE STATED
- Size:
- Date:
- B
- Number:
- Sheet
- Revision:
- of
- Drawn By:
- Brookfield, WI 53005
- File:
- Platform Base:
- Engineer:
- This Document is the property of MILWAUKEE TOOL and may not be reproduced, in any form, without the written premission of MILWAUKEE TOOL.

### Library data of the parts
C42-C44 C48-C50 C54 C55 = CMP-004-0070: CAP CER 0.1UF 50V X7R 0603; MFR#: C0603C104K5RACTU; MFR: KEMET; MFR2#: CC0603KRX7R9BB104; Tolerance: 10%; Temp Range: -55 / +125 C; Capacitor Type: Ceramic; Case Code (Imperial): 0608; Value: 0.1uF; Design Item ID: CN/0.1uF/50V/X7R/10%/0603; Case Code (Metric): 1608; ComponentLink1URL: https://product.tdk.com/info/en/catalog/datasheets/mlcc_automotive_midvoltage_en.pdf?ref_disty=digikey; MFR2: Yageo; ComponentLink1Description: Datasheet; Part Status: Production; Lead Free: *
C45-C47 C51-C53 C56 C57 = CMP-004-0076: CAP CER SMD 0.1UF 50V X7R 0402; MFR3#: KGM05CR71H104KH; MFR#: GRM155R71H104KE14D; MFR: Murata Electronics; MFR4#: CL05B104KB54PNC; MFR2#: C1005X7R1H104K050BB; Tolerance: 10%; Populate: Yes; Temp Range: -55 / +125 C; Capacitor Type: Ceramic; Case Code (Imperial): 0402; Value: 0.1uF; MFR4: Samsung Electro-Mechanics; Design Item ID: CN/0.1uF/50V/X7R/10%/0402; Case Code (Metric): 1005; ComponentLink1URL: https://search.murata.co.jp/Ceramy/image/img/A01X/G101/ENG/GRM155R71H104KE14-01.pdf; MFR3: KYOCERA AVX; MFR2: TDK Corporation; ComponentLink1Description: Datasheet; RoHS Compliant: Yes; Part Status: Production
R43-R45 R49-R51 R70 R71 R74 R76-R78 R97 R98 R101 R102 = CMP-025-0172: RES SMD 2M OHM 1% 1/16W 0402; MFR#: RC0402FR-072ML; MFR: YAGEO; Value: 2M Ohm; Temp Range: -55 / +155 C; Temperature Coefficient: 100ppm/°C; Populate: Yes; Tolerance: 1%; ComponentLink1Description: Datasheet; ComponentLink1URL: https://yageogroup.com/content/datasheet/asset/file/PYU-RC_GROUP_51_ROHS_L; Resistor Type: Thick Film; Case Code (Imperial): 0402; Case Code (Metric): 1005; Design Item ID: R/2.0M/0.063W/1%/0402; RoHS Compliant: Yes; Part Status: Production
R46 = CMP-025-0171: RES SMD 2.2K OHM 1% 1/16W 0402; MFR#: RC0402FR-072K2L; MFR: YAGEO; Voltage Rating: 250V; Temp Range: -55 / +155 C; Current: 6A; Temperature Coefficient: 100ppm/°C; Populate: Yes; Value: 2.2k Ohm; Tolerance: 1%; ComponentLink1Description: Datasheet; ComponentLink1URL: https://yageogroup.com/content/datasheet/asset/file/PYU-RC_GROUP_51_ROHS_L; Resistor Type: Thick Film; Case Code (Imperial): 0402; Case Code (Metric): 3216; Design Item ID: R/2.2K/0.063W/1%/0402; RoHS Compliant: Yes; Part Status: Production
R47 = CMP-025-0176: RES SMD 4.3K OHM 1% 1/16W 0402; MFR#: RC0402FR-074K3L; MFR: Yageo; Temp Range: -55 / +155 C; Temperature Coefficient: 50 ppm/°C; Populate: Yes; Value: 4.3k Ohm; Tolerance: 1%; ComponentLink1Description: Datasheet; ComponentLink1URL: https://yageogroup.com/content/datasheet/asset/file/PYU-RC_GROUP_51_ROHS_L; Resistor Type: Thick Film; Case Code (Imperial): 0402; Case Code (Metric): 1005; Design Item ID: R/4.3K/0.063W/1%/0402; RoHS Compliant: Yes; Part Status: Production
R48 R100 = CMP-025-0102: RES SMD 0 OHM JUMPER 1/16W 0402; MFR3#: CRCW04020000Z0ED; MFR: Stackpole Electronics Inc; MFR2#: AC0402JR-070RL; MFR4#: RS-02K000JT; MFR#: RMCF0402ZT0R00; Value: 0 ohm; Quality: AEC-Q200; Voltage Rating: 50V; Current: 1A; Temp Range: -55 / +155 C; Case Code (Metric): 1002; Case Code (Imperial): 0402; MFR2: YAGEO; Design Item ID: R/0.00/0.063W/JUMPER/0402; MFR4: FengHua; Resistor Type: Thick Film; ClassName: Fine_Pitch; MFR3: Vishay Dale; Tolerance: Jumper; REACH SVHC: Yes; RoHS Compliant: Yes
R52-R54 R57 R58 R60-R63 R79-R81 R84 R85 R87-R89 R94 R103 R104 R107-R110 = CMP-025-0026: RES SMD 10K OHM 0.5% 1/16W 0402; MFR2#: RNCF0402DTE10K0; MFR#: ERA-2AED103X; MFR: Panasonic Electronic Components; Temp Range: -55 / +155 C; Voltage Rating: 50V; Temperature Coefficient: 25ppm/°C; Quality: AEC-Q200; MFR2: Stackpole Electronics Inc; RoHS Compliant: Yes; ComponentLink1Description: Datasheet; REACH SVHC: Yes; Value: 10k; Case Code (Imperial): 0402; Case Code (Metric): 1005; Tolerance: 0.5%; Resistor Type: Thick Film; Design Item ID: R/10.0K/0.063W/0.5%/0402; ComponentLink1URL: https://industrial.panasonic.com/cdbs/www-data/pdf/RDM0000/AOA0000C307.pdf
R55 R56 R59 R82 R83 R86 R105 R106 = CMP-025-0173: RES SMD 1M OHM 1% 1/16W 0402; MFR#: RC0402FR-071ML; MFR: YAGEO; Value: 1M Ohm; Temp Range: -55 / +155 C; Temperature Coefficient: 100ppm/°C; Populate: Yes; Tolerance: 1%; ComponentLink1Description: Datasheet; ComponentLink1URL: https://yageogroup.com/content/datasheet/asset/file/PYU-RC_GROUP_51_ROHS_L; Resistor Type: Thick Film; Case Code (Imperial): 0402; Case Code (Metric): 1005; Design Item ID: R/1.0M/0.063W/1%/0402; RoHS Compliant: Yes; Part Status: Production
R64-R69 R90-R93 R95 R96 R111-R114 = CMP-025-0156: RES SMD 100 OHM 1% 1/16W 0402; MFR4#: CR0402-FX-1000GLF; MFR#: RMCF0402FT100R; MFR: Stackpole Electronics Inc; MFR3#: CRCW0402100RFKED; MFR2#: RC0402FR-07100RL; Value: 100 Ohm; Voltage Rating: 75V; Temp Range: -55 / +155 C; Current: 1A; Temperature Coefficient: 100ppm/°C; Populate: Yes; MFR2: YAGEO; Tolerance: 1%; MFR3: Vishay Dale; ComponentLink1Description: Datasheet; ComponentLink1URL: https://www.yageo.com/upload/media/product/products/datasheet/rchip/PYu-RC_Group_51_RoHS_L_12.pdf; Resistor Type: Thick Film; Case Code (Imperial): 0402; MFR4: Bourns Inc; Case Code (Metric): 1005; Design Item ID: R/100.0/0.063W/1%/0402; RoHS Compliant: Yes
R72 = CMP-025-0178: RES SMD 13K OHM 1% 1/16W 0402; MFR#: RC0402FR-0713KL; MFR: Yageo; Value: 13k Ohm; Temp Range: -55 / +155 C; Temperature Coefficient: 50 ppm/°C; Populate: Yes; Tolerance: 1%; ComponentLink1Description: Datasheet; ComponentLink1URL: https://yageogroup.com/content/datasheet/asset/file/PYU-RC_GROUP_51_ROHS_L; Resistor Type: Thick Film; Case Code (Imperial): 0402; Case Code (Metric): 1005; Design Item ID: R/13K/0.063W/1%/0402; RoHS Compliant: Yes; Part Status: Production
R73 = CMP-025-0179: RES SMD 22K OHM 1% 1/16W 0402; MFR#: RC0402FR-0722KL; MFR: Yageo; Value: 22k Ohm; Temp Range: -55 / +155 C; Temperature Coefficient: 50 ppm/°C; Populate: Yes; Tolerance: 1%; ComponentLink1Description: Datasheet; ComponentLink1URL: https://yageogroup.com/content/datasheet/asset/file/PYU-RC_GROUP_51_ROHS_L; Resistor Type: Thick Film; Case Code (Imperial): 0402; Case Code (Metric): 1005; Design Item ID: R/22K/0.063W/1%/0402; RoHS Compliant: Yes; Part Status: Production
R75 = CMP-025-0177: RES SMD 7.5K OHM 1% 1/16W 0402; MFR#: RC0402FR-077K5L; MFR: Yageo; Temp Range: -55 / +155 C; Temperature Coefficient: 50 ppm/°C; Populate: Yes; Value: 7.5k Ohm; Tolerance: 1%; ComponentLink1Description: Datasheet; ComponentLink1URL: https://yageogroup.com/content/datasheet/asset/file/PYU-RC_GROUP_51_ROHS_L; Resistor Type: Thick Film; Case Code (Imperial): 0402; Case Code (Metric): 1005; Design Item ID: R/7.5K/0.063W/1%/0402; RoHS Compliant: Yes; Part Status: Production
R99 = CMP-025-0180: RES SMD 43K OHM 1% 1/16W 0402; MFR#: RC0402FR-0743KL; MFR: Yageo; Value: 43k Ohm; Temp Range: -55 / +155 C; Temperature Coefficient: 50 ppm/°C; Populate: Yes; Tolerance: 1%; ComponentLink1Description: Datasheet; ComponentLink1URL: https://yageogroup.com/content/datasheet/asset/file/PYU-RC_GROUP_51_ROHS_L; Resistor Type: Thick Film; Case Code (Imperial): 0402; Case Code (Metric): 1005; Design Item ID: R/43K/0.063W/1%/0402; RoHS Compliant: Yes; Part Status: Production
TC1-TC8 = CMP-017-0115: IC THERMOCOUPLE AMPLIFIER I2C; MFR: Microchip; Value: MCP96L01T-E/MX; Populate: Yes; REACFH SVCH: Unaffected; Temp Range, Ambient: -40 / +125 C; Voltage Range: 2.3V / +5.5 V; Temp Range, Junction: -40 / +150C; MFR#: MCP96L01T-E/MX; Case Package: QFN-21N; Design Item ID: IC/TC/MCP96L01/QFN20; Part Status: Production; RoHS Comliant: Yes; Type: THERMOCOUPLE; ComponentLink1Description: Datasheet; ComponentLink1URL: https://ww1.microchip.com/downloads/en/DeviceDoc/MCP960X-L0X-RL0X-Data-Sheet-20005426F.pdf
TP1-TP16 TP33-TP64 = CMP-019-0006: TP SMT 1mm Circle; Value: TP_1mm; Populate: DNP; ClassName: Test Point; Design Item ID: TP_SMT_1MM_CIR; Shape/Size: 1mm Circle

## Sheet thermocouple_2.SchDoc
size B; Address1: MILWAUKEE TOOL; Address2: 13135 W. Lisbon Rd.; Address3: Brookfield, WI 53005; SheetNumber: 1; SheetTotal: 1
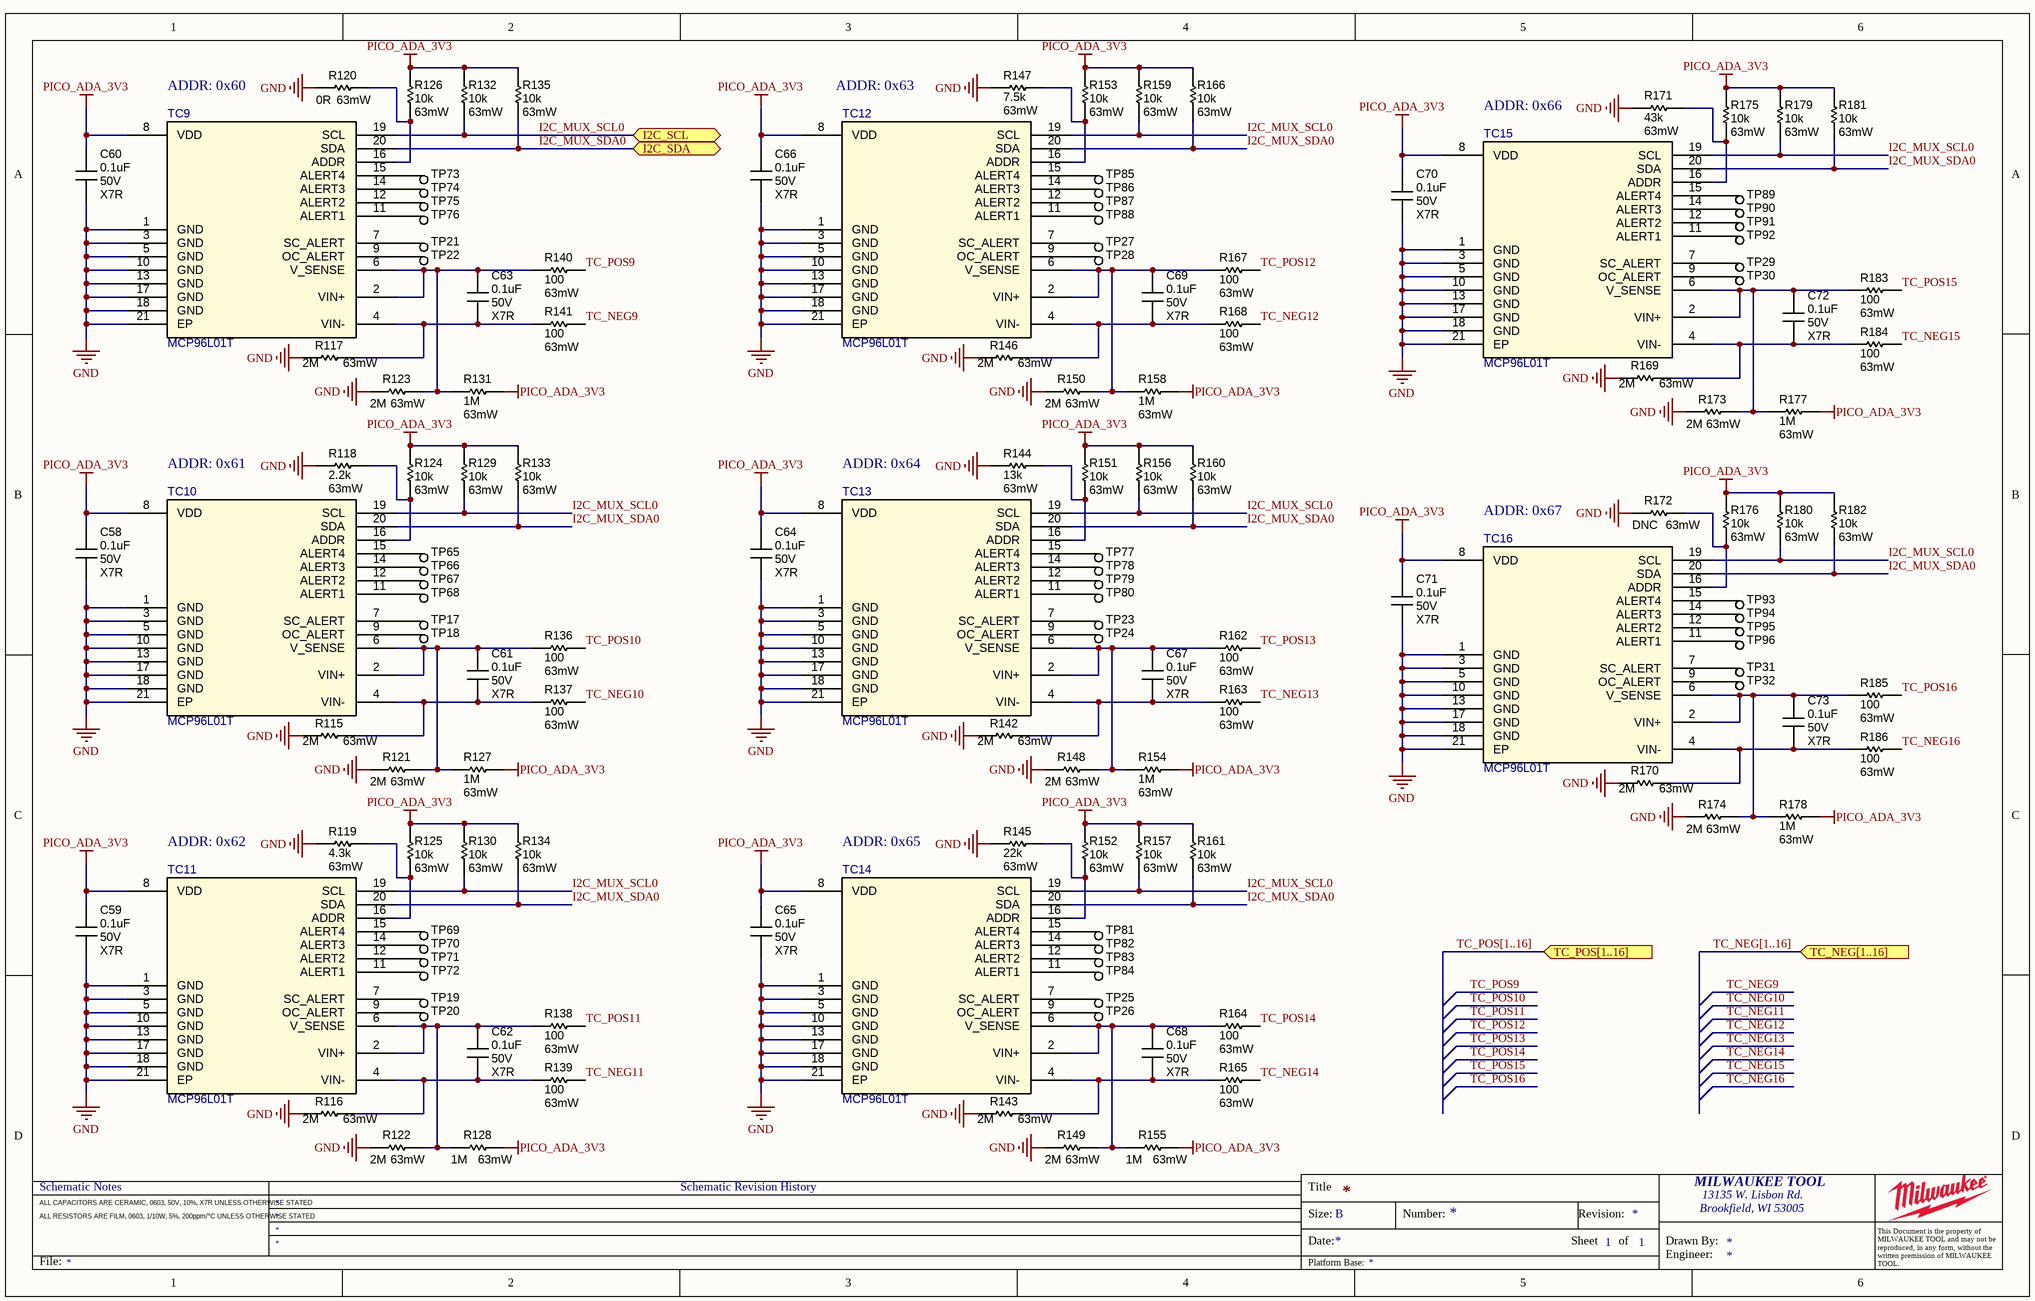
[diagram p8: thermocouple_2.SchDoc]

### Parts
C58  0.1uF  Voltage Rating: 50V  Temp Coeff: X7R  [CAPC1608X09N]
C59  0.1uF  Voltage Rating: 50V  Temp Coeff: X7R  [CAPC1608X09N]
C60  0.1uF  Voltage Rating: 50V  Temp Coeff: X7R  [CAPC1608X09N]
C61  0.1uF  Voltage Rating: 50V  Temp Coeff: X7R  [CAPC1005X06N]
C62  0.1uF  Voltage Rating: 50V  Temp Coeff: X7R  [CAPC1005X06N]
C63  0.1uF  Voltage Rating: 50V  Temp Coeff: X7R  [CAPC1005X06N]
C64  0.1uF  Voltage Rating: 50V  Temp Coeff: X7R  [CAPC1608X09N]
C65  0.1uF  Voltage Rating: 50V  Temp Coeff: X7R  [CAPC1608X09N]
C66  0.1uF  Voltage Rating: 50V  Temp Coeff: X7R  [CAPC1608X09N]
C67  0.1uF  Voltage Rating: 50V  Temp Coeff: X7R  [CAPC1005X06N]
C68  0.1uF  Voltage Rating: 50V  Temp Coeff: X7R  [CAPC1005X06N]
C69  0.1uF  Voltage Rating: 50V  Temp Coeff: X7R  [CAPC1005X06N]
C70  0.1uF  Voltage Rating: 50V  Temp Coeff: X7R  [CAPC1608X09N]
C71  0.1uF  Voltage Rating: 50V  Temp Coeff: X7R  [CAPC1608X09N]
C72  0.1uF  Voltage Rating: 50V  Temp Coeff: X7R  [CAPC1005X06N]
C73  0.1uF  Voltage Rating: 50V  Temp Coeff: X7R  [CAPC1005X06N]
R115  2M  Wattage: 63mW  [RESC1005X04N]
R116  2M  Wattage: 63mW  [RESC1005X04N]
R117  2M  Wattage: 63mW  [RESC1005X04N]
R118  2.2k  Wattage: 63mW  [RESC1005X04N]
R119  4.3k  Wattage: 63mW  [RESC1005X04N]
R120  0R  Wattage: 63mW  [RESC1005X04N]
R121  2M  Wattage: 63mW  [RESC1005X04N]
R122  2M  Wattage: 63mW  [RESC1005X04N]
R123  2M  Wattage: 63mW  [RESC1005X04N]
R124  10k  Wattage: 63mW  [RESC1005X04N]
R125  10k  Wattage: 63mW  [RESC1005X04N]
R126  10k  Wattage: 63mW  [RESC1005X04N]
R127  1M  Wattage: 63mW  [RESC1005X04N]
R128  1M  Wattage: 63mW  [RESC1005X04N]
R129  10k  Wattage: 63mW  [RESC1005X04N]
R130  10k  Wattage: 63mW  [RESC1005X04N]
R131  1M  Wattage: 63mW  [RESC1005X04N]
R132  10k  Wattage: 63mW  [RESC1005X04N]
R133  10k  Wattage: 63mW  [RESC1005X04N]
R134  10k  Wattage: 63mW  [RESC1005X04N]
R135  10k  Wattage: 63mW  [RESC1005X04N]
R136  100  Wattage: 63mW  [RESC1005X04N]
R137  100  Wattage: 63mW  [RESC1005X04N]
R138  100  Wattage: 63mW  [RESC1005X04N]
R139  100  Wattage: 63mW  [RESC1005X04N]
R140  100  Wattage: 63mW  [RESC1005X04N]
R141  100  Wattage: 63mW  [RESC1005X04N]
R142  2M  Wattage: 63mW  [RESC1005X04N]
R143  2M  Wattage: 63mW  [RESC1005X04N]
R144  13k  Wattage: 63mW  [RESC1005X04N]
R145  22k  Wattage: 63mW  [RESC1005X04N]
R146  2M  Wattage: 63mW  [RESC1005X04N]
R147  7.5k  Wattage: 63mW  [RESC1005X04N]
R148  2M  Wattage: 63mW  [RESC1005X04N]
R149  2M  Wattage: 63mW  [RESC1005X04N]
R150  2M  Wattage: 63mW  [RESC1005X04N]
R151  10k  Wattage: 63mW  [RESC1005X04N]
R152  10k  Wattage: 63mW  [RESC1005X04N]
R153  10k  Wattage: 63mW  [RESC1005X04N]
R154  1M  Wattage: 63mW  [RESC1005X04N]
R155  1M  Wattage: 63mW  [RESC1005X04N]
R156  10k  Wattage: 63mW  [RESC1005X04N]
R157  10k  Wattage: 63mW  [RESC1005X04N]
R158  1M  Wattage: 63mW  [RESC1005X04N]
R159  10k  Wattage: 63mW  [RESC1005X04N]
R160  10k  Wattage: 63mW  [RESC1005X04N]
R161  10k  Wattage: 63mW  [RESC1005X04N]
R162  100  Wattage: 63mW  [RESC1005X04N]
R163  100  Wattage: 63mW  [RESC1005X04N]
R164  100  Wattage: 63mW  [RESC1005X04N]
R165  100  Wattage: 63mW  [RESC1005X04N]
R166  10k  Wattage: 63mW  [RESC1005X04N]
R167  100  Wattage: 63mW  [RESC1005X04N]
R168  100  Wattage: 63mW  [RESC1005X04N]
R169  2M  Wattage: 63mW  [RESC1005X04N]
R170  2M  Wattage: 63mW  [RESC1005X04N]
R171  43k  Wattage: 63mW  [RESC1005X04N]
R172  DNC  Wattage: 63mW  [RESC1005X04N]
R173  2M  Wattage: 63mW  [RESC1005X04N]
R174  2M  Wattage: 63mW  [RESC1005X04N]
R175  10k  Wattage: 63mW  [RESC1005X04N]
R176  10k  Wattage: 63mW  [RESC1005X04N]
R177  1M  Wattage: 63mW  [RESC1005X04N]
R178  1M  Wattage: 63mW  [RESC1005X04N]
R179  10k  Wattage: 63mW  [RESC1005X04N]
R180  10k  Wattage: 63mW  [RESC1005X04N]
R181  10k  Wattage: 63mW  [RESC1005X04N]
R182  10k  Wattage: 63mW  [RESC1005X04N]
R183  100  Wattage: 63mW  [RESC1005X04N]
R184  100  Wattage: 63mW  [RESC1005X04N]
R185  100  Wattage: 63mW  [RESC1005X04N]
R186  100  Wattage: 63mW  [RESC1005X04N]
TC9  MCP96L01T  [QFN65P500X500X100_HS-21N]
TC10  MCP96L01T  [QFN65P500X500X100_HS-21N]
TC11  MCP96L01T  [QFN65P500X500X100_HS-21N]
TC12  MCP96L01T  [QFN65P500X500X100_HS-21N]
TC13  MCP96L01T  [QFN65P500X500X100_HS-21N]
TC14  MCP96L01T  [QFN65P500X500X100_HS-21N]
TC15  MCP96L01T  [QFN65P500X500X100_HS-21N]
TC16  MCP96L01T  [QFN65P500X500X100_HS-21N]
TP17  TP_SMT_1MM_CIR  [TP_SMT_1.0MM_CIR]  (value not drawn)  (no BOM)
TP18  TP_SMT_1MM_CIR  [TP_SMT_1.0MM_CIR]  (value not drawn)  (no BOM)
TP19  TP_SMT_1MM_CIR  [TP_SMT_1.0MM_CIR]  (value not drawn)  (no BOM)
TP20  TP_SMT_1MM_CIR  [TP_SMT_1.0MM_CIR]  (value not drawn)  (no BOM)
TP21  TP_SMT_1MM_CIR  [TP_SMT_1.0MM_CIR]  (value not drawn)  (no BOM)
TP22  TP_SMT_1MM_CIR  [TP_SMT_1.0MM_CIR]  (value not drawn)  (no BOM)
TP23  TP_SMT_1MM_CIR  [TP_SMT_1.0MM_CIR]  (value not drawn)  (no BOM)
TP24  TP_SMT_1MM_CIR  [TP_SMT_1.0MM_CIR]  (value not drawn)  (no BOM)
TP25  TP_SMT_1MM_CIR  [TP_SMT_1.0MM_CIR]  (value not drawn)  (no BOM)
TP26  TP_SMT_1MM_CIR  [TP_SMT_1.0MM_CIR]  (value not drawn)  (no BOM)
TP27  TP_SMT_1MM_CIR  [TP_SMT_1.0MM_CIR]  (value not drawn)  (no BOM)
TP28  TP_SMT_1MM_CIR  [TP_SMT_1.0MM_CIR]  (value not drawn)  (no BOM)
TP29  TP_SMT_1MM_CIR  [TP_SMT_1.0MM_CIR]  (value not drawn)  (no BOM)
TP30  TP_SMT_1MM_CIR  [TP_SMT_1.0MM_CIR]  (value not drawn)  (no BOM)
TP31  TP_SMT_1MM_CIR  [TP_SMT_1.0MM_CIR]  (value not drawn)  (no BOM)
TP32  TP_SMT_1MM_CIR  [TP_SMT_1.0MM_CIR]  (value not drawn)  (no BOM)
TP65  TP_SMT_1MM_CIR  [TP_SMT_1.0MM_CIR]  (value not drawn)  (no BOM)
TP66  TP_SMT_1MM_CIR  [TP_SMT_1.0MM_CIR]  (value not drawn)  (no BOM)
TP67  TP_SMT_1MM_CIR  [TP_SMT_1.0MM_CIR]  (value not drawn)  (no BOM)
TP68  TP_SMT_1MM_CIR  [TP_SMT_1.0MM_CIR]  (value not drawn)  (no BOM)
TP69  TP_SMT_1MM_CIR  [TP_SMT_1.0MM_CIR]  (value not drawn)  (no BOM)
TP70  TP_SMT_1MM_CIR  [TP_SMT_1.0MM_CIR]  (value not drawn)  (no BOM)
TP71  TP_SMT_1MM_CIR  [TP_SMT_1.0MM_CIR]  (value not drawn)  (no BOM)
TP72  TP_SMT_1MM_CIR  [TP_SMT_1.0MM_CIR]  (value not drawn)  (no BOM)
TP73  TP_SMT_1MM_CIR  [TP_SMT_1.0MM_CIR]  (value not drawn)  (no BOM)
TP74  TP_SMT_1MM_CIR  [TP_SMT_1.0MM_CIR]  (value not drawn)  (no BOM)
TP75  TP_SMT_1MM_CIR  [TP_SMT_1.0MM_CIR]  (value not drawn)  (no BOM)
TP76  TP_SMT_1MM_CIR  [TP_SMT_1.0MM_CIR]  (value not drawn)  (no BOM)
TP77  TP_SMT_1MM_CIR  [TP_SMT_1.0MM_CIR]  (value not drawn)  (no BOM)
TP78  TP_SMT_1MM_CIR  [TP_SMT_1.0MM_CIR]  (value not drawn)  (no BOM)
TP79  TP_SMT_1MM_CIR  [TP_SMT_1.0MM_CIR]  (value not drawn)  (no BOM)
TP80  TP_SMT_1MM_CIR  [TP_SMT_1.0MM_CIR]  (value not drawn)  (no BOM)
TP81  TP_SMT_1MM_CIR  [TP_SMT_1.0MM_CIR]  (value not drawn)  (no BOM)
TP82  TP_SMT_1MM_CIR  [TP_SMT_1.0MM_CIR]  (value not drawn)  (no BOM)
TP83  TP_SMT_1MM_CIR  [TP_SMT_1.0MM_CIR]  (value not drawn)  (no BOM)
TP84  TP_SMT_1MM_CIR  [TP_SMT_1.0MM_CIR]  (value not drawn)  (no BOM)
TP85  TP_SMT_1MM_CIR  [TP_SMT_1.0MM_CIR]  (value not drawn)  (no BOM)
TP86  TP_SMT_1MM_CIR  [TP_SMT_1.0MM_CIR]  (value not drawn)  (no BOM)
TP87  TP_SMT_1MM_CIR  [TP_SMT_1.0MM_CIR]  (value not drawn)  (no BOM)
TP88  TP_SMT_1MM_CIR  [TP_SMT_1.0MM_CIR]  (value not drawn)  (no BOM)
TP89  TP_SMT_1MM_CIR  [TP_SMT_1.0MM_CIR]  (value not drawn)  (no BOM)
TP90  TP_SMT_1MM_CIR  [TP_SMT_1.0MM_CIR]  (value not drawn)  (no BOM)
TP91  TP_SMT_1MM_CIR  [TP_SMT_1.0MM_CIR]  (value not drawn)  (no BOM)
TP92  TP_SMT_1MM_CIR  [TP_SMT_1.0MM_CIR]  (value not drawn)  (no BOM)
TP93  TP_SMT_1MM_CIR  [TP_SMT_1.0MM_CIR]  (value not drawn)  (no BOM)
TP94  TP_SMT_1MM_CIR  [TP_SMT_1.0MM_CIR]  (value not drawn)  (no BOM)
TP95  TP_SMT_1MM_CIR  [TP_SMT_1.0MM_CIR]  (value not drawn)  (no BOM)
TP96  TP_SMT_1MM_CIR  [TP_SMT_1.0MM_CIR]  (value not drawn)  (no BOM)

### Ports
I2C_SCL (bidir), I2C_SDA (bidir), TC_NEG[1..16] (in), TC_POS[1..16] (in)

### Nets
GND: C58.2 C59.2 C60.2 C64.2 C65.2 C66.2 C70.2 C71.2 R115.1 R116.1 R117.1 R118.1 R119.1 R120.1 R121.1 R122.1 R123.1 R142.1 R143.1 R144.1 R145.1 R146.1 R147.1 R148.1 R149.1 R150.1 R169.1 R170.1 R171.1 R172.1 R173.1 R174.1 TC9.1(GND) TC9.3(GND) TC9.5(GND) TC9.10(GND) TC9.13(GND) TC9.17(GND) TC9.18(GND) TC9.21(EP) TC10.1(GND) TC10.3(GND) TC10.5(GND) TC10.10(GND) TC10.13(GND) TC10.17(GND) TC10.18(GND) TC10.21(EP) TC11.1(GND) TC11.3(GND) TC11.5(GND) TC11.10(GND) TC11.13(GND) TC11.17(GND) TC11.18(GND) TC11.21(EP) TC12.1(GND) TC12.3(GND) TC12.5(GND) TC12.10(GND) TC12.13(GND) TC12.17(GND) TC12.18(GND) TC12.21(EP) TC13.1(GND) TC13.3(GND) TC13.5(GND) TC13.10(GND) TC13.13(GND) TC13.17(GND) TC13.18(GND) TC13.21(EP) TC14.1(GND) TC14.3(GND) TC14.5(GND) TC14.10(GND) TC14.13(GND) TC14.17(GND) TC14.18(GND) TC14.21(EP) TC15.1(GND) TC15.3(GND) TC15.5(GND) TC15.10(GND) TC15.13(GND) TC15.17(GND) TC15.18(GND) TC15.21(EP) TC16.1(GND) TC16.3(GND) TC16.5(GND) TC16.10(GND) TC16.13(GND) TC16.17(GND) TC16.18(GND) TC16.21(EP)
PICO_ADA_3V3: C58.1 C59.1 C60.1 C64.1 C65.1 C66.1 C70.1 C71.1 R124.2 R125.2 R126.2 R127.2 R128.2 R129.2 R130.2 R131.2 R132.2 R133.2 R134.2 R135.2 R151.2 R152.2 R153.2 R154.2 R155.2 R156.2 R157.2 R158.2 R159.2 R160.2 R161.2 R166.2 R175.2 R176.2 R177.2 R178.2 R179.2 R180.2 R181.2 R182.2 TC9.8(VDD) TC10.8(VDD) TC11.8(VDD) TC12.8(VDD) TC13.8(VDD) TC14.8(VDD) TC15.8(VDD) TC16.8(VDD)
I2C_MUX_SCL0: R129.1 R130.1 R132.1 R156.1 R157.1 R159.1 R179.1 R180.1 TC9.19(SCL) TC10.19(SCL) TC11.19(SCL) TC12.19(SCL) TC13.19(SCL) TC14.19(SCL) TC15.19(SCL) TC16.19(SCL) ; port I2C_SCL
I2C_MUX_SDA0: R133.1 R134.1 R135.1 R160.1 R161.1 R166.1 R181.1 R182.1 TC9.20(SDA) TC10.20(SDA) TC11.20(SDA) TC12.20(SDA) TC13.20(SDA) TC14.20(SDA) TC15.20(SDA) TC16.20(SDA) ; port I2C_SDA
TC_NEG9: R141.2
TC_NEG10: R137.2
TC_NEG11: R139.2
TC_NEG12: R168.2
TC_NEG13: R163.2
TC_NEG14: R165.2
TC_NEG15: R184.2
TC_NEG16: R186.2
TC_POS9: R140.2
TC_POS10: R136.2
TC_POS11: R138.2
TC_POS12: R167.2
TC_POS13: R162.2
TC_POS14: R164.2
TC_POS15: R183.2
TC_POS16: R185.2
NetC61_1: C61.1 R121.2 R127.1 R136.1 TC10.2(VIN+) TC10.6(V_SENSE)
NetC61_2: C61.2 R115.2 R137.1 TC10.4(VIN-)
NetC62_1: C62.1 R122.2 R128.1 R138.1 TC11.2(VIN+) TC11.6(V_SENSE)
NetC62_2: C62.2 R116.2 R139.1 TC11.4(VIN-)
NetC63_1: C63.1 R123.2 R131.1 R140.1 TC9.2(VIN+) TC9.6(V_SENSE)
NetC63_2: C63.2 R117.2 R141.1 TC9.4(VIN-)
NetC67_1: C67.1 R148.2 R154.1 R162.1 TC13.2(VIN+) TC13.6(V_SENSE)
NetC67_2: C67.2 R142.2 R163.1 TC13.4(VIN-)
NetC68_1: C68.1 R149.2 R155.1 R164.1 TC14.2(VIN+) TC14.6(V_SENSE)
NetC68_2: C68.2 R143.2 R165.1 TC14.4(VIN-)
NetC69_1: C69.1 R150.2 R158.1 R167.1 TC12.2(VIN+) TC12.6(V_SENSE)
NetC69_2: C69.2 R146.2 R168.1 TC12.4(VIN-)
NetC72_1: C72.1 R173.2 R177.1 R183.1 TC15.2(VIN+) TC15.6(V_SENSE)
NetC72_2: C72.2 R169.2 R184.1 TC15.4(VIN-)
NetC73_1: C73.1 R174.2 R178.1 R185.1 TC16.2(VIN+) TC16.6(V_SENSE)
NetC73_2: C73.2 R170.2 R186.1 TC16.4(VIN-)
NetR118_2: R118.2 R124.1 TC10.16(ADDR)
NetR119_2: R119.2 R125.1 TC11.16(ADDR)
NetR120_2: R120.2 R126.1 TC9.16(ADDR)
NetR144_2: R144.2 R151.1 TC13.16(ADDR)
NetR145_2: R145.2 R152.1 TC14.16(ADDR)
NetR147_2: R147.2 R153.1 TC12.16(ADDR)
NetR171_2: R171.2 R175.1 TC15.16(ADDR)
NetR172_2: R172.2 R176.1 TC16.16(ADDR)
NetTC9_7: TC9.7(SC_ALERT) TP21.1
NetTC9_9: TC9.9(OC_ALERT) TP22.1
NetTC9_11: TC9.11(ALERT1) TP76.1
NetTC9_12: TC9.12(ALERT2) TP75.1
NetTC9_14: TC9.14(ALERT3) TP74.1
NetTC9_15: TC9.15(ALERT4) TP73.1
NetTC10_7: TC10.7(SC_ALERT) TP17.1
NetTC10_9: TC10.9(OC_ALERT) TP18.1
NetTC10_11: TC10.11(ALERT1) TP68.1
NetTC10_12: TC10.12(ALERT2) TP67.1
NetTC10_14: TC10.14(ALERT3) TP66.1
NetTC10_15: TC10.15(ALERT4) TP65.1
NetTC11_7: TC11.7(SC_ALERT) TP19.1
NetTC11_9: TC11.9(OC_ALERT) TP20.1
NetTC11_11: TC11.11(ALERT1) TP72.1
NetTC11_12: TC11.12(ALERT2) TP71.1
NetTC11_14: TC11.14(ALERT3) TP70.1
NetTC11_15: TC11.15(ALERT4) TP69.1
NetTC12_7: TC12.7(SC_ALERT) TP27.1
NetTC12_9: TC12.9(OC_ALERT) TP28.1
NetTC12_11: TC12.11(ALERT1) TP88.1
NetTC12_12: TC12.12(ALERT2) TP87.1
NetTC12_14: TC12.14(ALERT3) TP86.1
NetTC12_15: TC12.15(ALERT4) TP85.1
NetTC13_7: TC13.7(SC_ALERT) TP23.1
NetTC13_9: TC13.9(OC_ALERT) TP24.1
NetTC13_11: TC13.11(ALERT1) TP80.1
NetTC13_12: TC13.12(ALERT2) TP79.1
NetTC13_14: TC13.14(ALERT3) TP78.1
NetTC13_15: TC13.15(ALERT4) TP77.1
NetTC14_7: TC14.7(SC_ALERT) TP25.1
NetTC14_9: TC14.9(OC_ALERT) TP26.1
NetTC14_11: TC14.11(ALERT1) TP84.1
NetTC14_12: TC14.12(ALERT2) TP83.1
NetTC14_14: TC14.14(ALERT3) TP82.1
NetTC14_15: TC14.15(ALERT4) TP81.1
NetTC15_7: TC15.7(SC_ALERT) TP29.1
NetTC15_9: TC15.9(OC_ALERT) TP30.1
NetTC15_11: TC15.11(ALERT1) TP92.1
NetTC15_12: TC15.12(ALERT2) TP91.1
NetTC15_14: TC15.14(ALERT3) TP90.1
NetTC15_15: TC15.15(ALERT4) TP89.1
NetTC16_7: TC16.7(SC_ALERT) TP31.1
NetTC16_9: TC16.9(OC_ALERT) TP32.1
NetTC16_11: TC16.11(ALERT1) TP96.1
NetTC16_12: TC16.12(ALERT2) TP95.1
NetTC16_14: TC16.14(ALERT3) TP94.1
NetTC16_15: TC16.15(ALERT4) TP93.1

### Buses and harness runs
bus TC_NEG[1..16] = port TC_NEG[1..16]
bus TC_POS[1..16] = port TC_POS[1..16]

### Notes on the sheet
- (near TC9) ADDR: 0x60
- (near TC12) ADDR: 0x63
- (near TC15) ADDR: 0x66
- (near TC10) ADDR: 0x61
- (near TC13) ADDR: 0x64
- (near TC16) ADDR: 0x67
- (near TC11) ADDR: 0x62
- (near TC14) ADDR: 0x65
- Schematic Notes
- Schematic Revision History
- Title
- ALL CAPACITORS ARE CERAMIC, 0603, 50V, 10%, X7R UNLESS OTHERWISE STATED
- ALL RESISTORS ARE FILM, 0603, 1/10W, 5%, 200ppm/°C UNLESS OTHERWISE STATED
- Size:
- Date:
- B
- Number:
- Sheet
- Revision:
- of
- Drawn By:
- Brookfield, WI 53005
- File:
- Platform Base:
- Engineer:
- This Document is the property of MILWAUKEE TOOL and may not be reproduced, in any form, without the written premission of MILWAUKEE TOOL.

### Library data of the parts
C58-C60 C64-C66 C70 C71 = CMP-004-0070: as C42 on sheet thermocouple_1; Case Code (Imperial): 0608; Value: 0.1uF; Design Item ID: CN/0.1uF/50V/X7R/10%/0603; Case Code (Metric): 1608; ComponentLink1URL: https://product.tdk.com/info/en/catalog/datasheets/mlcc_automotive_midvoltage_en.pdf?ref_disty=digikey; MFR2: Yageo; ComponentLink1Description: Datasheet; Part Status: Production; Lead Free: *
C61-C63 C67-C69 C72 C73 = CMP-004-0076: as C45-C47 on sheet thermocouple_1; Case Code (Imperial): 0402; Value: 0.1uF; MFR4: Samsung Electro-Mechanics; Design Item ID: CN/0.1uF/50V/X7R/10%/0402; Case Code (Metric): 1005; ComponentLink1URL: https://search.murata.co.jp/Ceramy/image/img/A01X/G101/ENG/GRM155R71H104KE14-01.pdf; MFR3: KYOCERA AVX; MFR2: TDK Corporation; ComponentLink1Description: Datasheet; RoHS Compliant: Yes; Part Status: Production
R115-R117 R121-R123 R142 R143 R146 R148-R150 R169 R170 R173 R174 = CMP-025-0172: as R43 on sheet thermocouple_1; Tolerance: 1%; ComponentLink1Description: Datasheet; ComponentLink1URL: https://yageogroup.com/content/datasheet/asset/file/PYU-RC_GROUP_51_ROHS_L; Resistor Type: Thick Film; Case Code (Imperial): 0402; Case Code (Metric): 1005; Design Item ID: R/2.0M/0.063W/1%/0402; RoHS Compliant: Yes; Part Status: Production
R118 = CMP-025-0171: as R46 on sheet thermocouple_1; Value: 2.2k Ohm; Tolerance: 1%; ComponentLink1Description: Datasheet; ComponentLink1URL: https://yageogroup.com/content/datasheet/asset/file/PYU-RC_GROUP_51_ROHS_L; Resistor Type: Thick Film; Case Code (Imperial): 0402; Case Code (Metric): 3216; Design Item ID: R/2.2K/0.063W/1%/0402; RoHS Compliant: Yes; Part Status: Production
R119 = CMP-025-0176: as R47 on sheet thermocouple_1; Value: 4.3k Ohm; Tolerance: 1%; ComponentLink1Description: Datasheet; ComponentLink1URL: https://yageogroup.com/content/datasheet/asset/file/PYU-RC_GROUP_51_ROHS_L; Resistor Type: Thick Film; Case Code (Imperial): 0402; Case Code (Metric): 1005; Design Item ID: R/4.3K/0.063W/1%/0402; RoHS Compliant: Yes; Part Status: Production
R120 R172 = CMP-025-0102: as R48 on sheet thermocouple_1; Case Code (Metric): 1002; Case Code (Imperial): 0402; MFR2: YAGEO; Design Item ID: R/0.00/0.063W/JUMPER/0402; MFR4: FengHua; Resistor Type: Thick Film; ClassName: Fine_Pitch; MFR3: Vishay Dale; Tolerance: Jumper; REACH SVHC: Yes; RoHS Compliant: Yes
R124-R126 R129 R130 R132-R135 R151-R153 R156 R157 R159-R161 R166 R175 R176 R179-R182 = CMP-025-0026: as R52-R54 on sheet thermocouple_1; MFR2: Stackpole Electronics Inc; RoHS Compliant: Yes; ComponentLink1Description: Datasheet; REACH SVHC: Yes; Value: 10k; Case Code (Imperial): 0402; Case Code (Metric): 1005; Tolerance: 0.5%; Resistor Type: Thick Film; Design Item ID: R/10.0K/0.063W/0.5%/0402; ComponentLink1URL: https://industrial.panasonic.com/cdbs/www-data/pdf/RDM0000/AOA0000C307.pdf
R127 R128 R131 R154 R155 R158 R177 R178 = CMP-025-0173: as R55 on sheet thermocouple_1; Tolerance: 1%; ComponentLink1Description: Datasheet; ComponentLink1URL: https://yageogroup.com/content/datasheet/asset/file/PYU-RC_GROUP_51_ROHS_L; Resistor Type: Thick Film; Case Code (Imperial): 0402; Case Code (Metric): 1005; Design Item ID: R/1.0M/0.063W/1%/0402; RoHS Compliant: Yes; Part Status: Production
R136-R141 R162-R165 R167 R168 R183-R186 = CMP-025-0156: as R64 on sheet thermocouple_1; MFR2: YAGEO; Tolerance: 1%; MFR3: Vishay Dale; ComponentLink1Description: Datasheet; ComponentLink1URL: https://www.yageo.com/upload/media/product/products/datasheet/rchip/PYu-RC_Group_51_RoHS_L_12.pdf; Resistor Type: Thick Film; Case Code (Imperial): 0402; MFR4: Bourns Inc; Case Code (Metric): 1005; Design Item ID: R/100.0/0.063W/1%/0402; RoHS Compliant: Yes
R144 = CMP-025-0178: as R72 on sheet thermocouple_1; Tolerance: 1%; ComponentLink1Description: Datasheet; ComponentLink1URL: https://yageogroup.com/content/datasheet/asset/file/PYU-RC_GROUP_51_ROHS_L; Resistor Type: Thick Film; Case Code (Imperial): 0402; Case Code (Metric): 1005; Design Item ID: R/13K/0.063W/1%/0402; RoHS Compliant: Yes; Part Status: Production
R145 = CMP-025-0179: as R73 on sheet thermocouple_1; Tolerance: 1%; ComponentLink1Description: Datasheet; ComponentLink1URL: https://yageogroup.com/content/datasheet/asset/file/PYU-RC_GROUP_51_ROHS_L; Resistor Type: Thick Film; Case Code (Imperial): 0402; Case Code (Metric): 1005; Design Item ID: R/22K/0.063W/1%/0402; RoHS Compliant: Yes; Part Status: Production
R147 = CMP-025-0177: as R75 on sheet thermocouple_1; Value: 7.5k Ohm; Tolerance: 1%; ComponentLink1Description: Datasheet; ComponentLink1URL: https://yageogroup.com/content/datasheet/asset/file/PYU-RC_GROUP_51_ROHS_L; Resistor Type: Thick Film; Case Code (Imperial): 0402; Case Code (Metric): 1005; Design Item ID: R/7.5K/0.063W/1%/0402; RoHS Compliant: Yes; Part Status: Production
R171 = CMP-025-0180: as R99 on sheet thermocouple_1; Tolerance: 1%; ComponentLink1Description: Datasheet; ComponentLink1URL: https://yageogroup.com/content/datasheet/asset/file/PYU-RC_GROUP_51_ROHS_L; Resistor Type: Thick Film; Case Code (Imperial): 0402; Case Code (Metric): 1005; Design Item ID: R/43K/0.063W/1%/0402; RoHS Compliant: Yes; Part Status: Production
TC9-TC16 = CMP-017-0115: as TC1 on sheet thermocouple_1; MFR#: MCP96L01T-E/MX; Case Package: QFN-21N; Design Item ID: IC/TC/MCP96L01/QFN20; Part Status: Production; RoHS Comliant: Yes; Type: THERMOCOUPLE; ComponentLink1Description: Datasheet; ComponentLink1URL: https://ww1.microchip.com/downloads/en/DeviceDoc/MCP960X-L0X-RL0X-Data-Sheet-20005426F.pdf
TP17-TP32 TP65-TP96 = CMP-019-0006: as TP1 on sheet thermocouple_1; ClassName: Test Point; Design Item ID: TP_SMT_1MM_CIR; Shape/Size: 1mm Circle